# Altium schematic sheet Guide_laser.SchDoc
size 420 x 297 mm; Address1: Address1; Address2: Address2; Address3: Address3; Address4: Address4; DocumentNumber: *Э3; SheetNumber: 6; SheetTotal: 14; DocumentType: Схема электрическая *
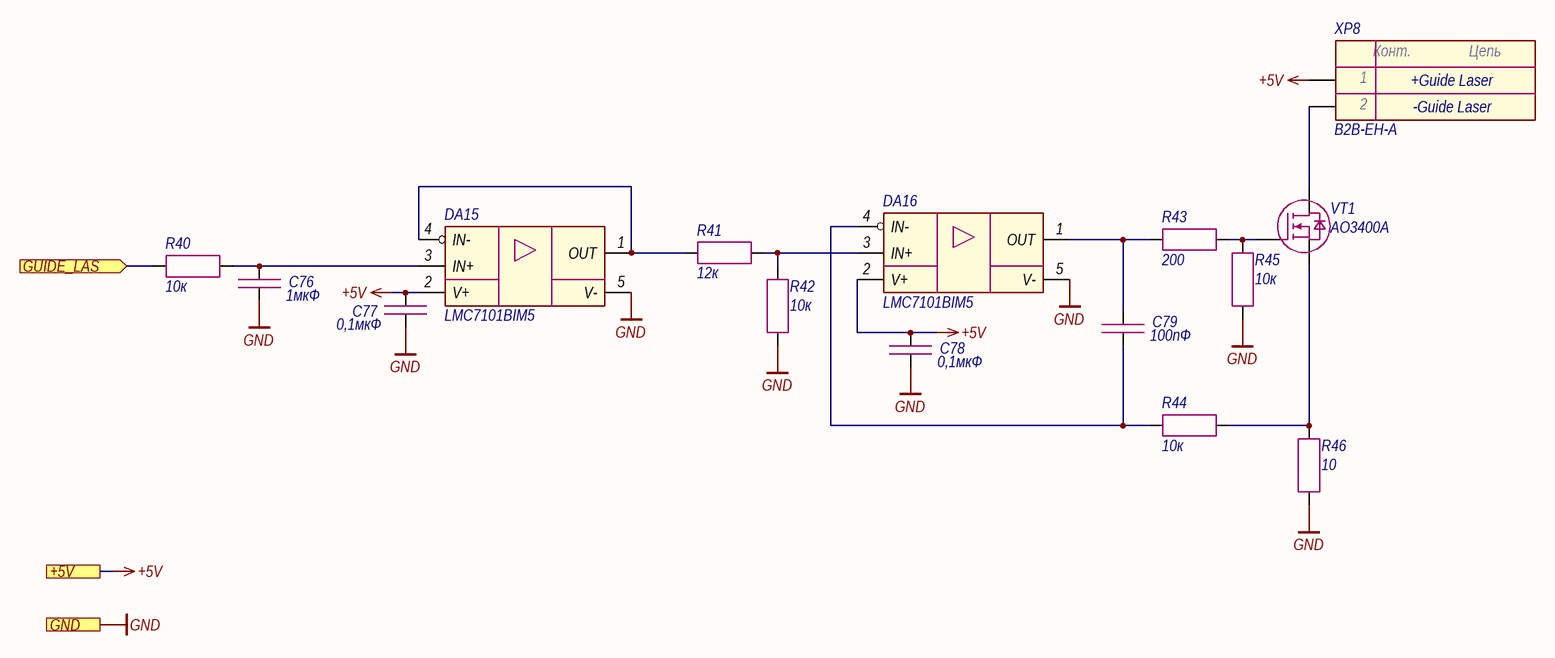
[diagram p0: Guide_laser.SchDoc]

## Parts
C76  1мкФ  [CAP_0603]
C77  0,1мкФ  [CAP_0603]
C78  0,1мкФ  [CAP_0603]
C79  100пФ  [CAP_0603]
DA15  LMC7101BIM5  [SOT-23-5]
DA16  LMC7101BIM5  [SOT-23-5]
R40  10к  [RES_0603]
R41  12к  [RES_0603]
R42  10к  [RES_0603]
R43  200  [RES_0603]
R44  10к  [RES_0603]
R45  10к  [RES_0603]
R46  10  [RES_1210]
VT1  AO3400A  [SOT-23-3]
XP8  B2B-EH-A  [B2B-EH-A]

## Ports
+5V (see Main[2C]), GND (see Main[2C], Button[1D], Column[1C], Ethernet[3D], Fiber_interlock[2C], Flow_sensor[2C], Indication[1C], LD_driver[1D], Power_supply[2C], RS-485[2C]), GUIDE_LAS (in, see Main[2C])

## Nets
+5V: C77.1 C78.1 DA15.2(V+) DA16.2(V+) XP8.1 ; port +5V
GND: C76.2 C77.2 C78.2 DA15.5(V-) DA16.5(V-) R42.2 R45.1 R46.1 ; port GND
GUIDE_LAS: R40.1 ; port GUIDE_LAS
NetC76_1: C76.1 DA15.3(IN+) R40.2
NetC79_1: C79.1 DA16.1(OUT) R43.1
NetC79_2: C79.2 DA16.4(IN-) R44.1
NetDA15_1: DA15.1(OUT) DA15.4(IN-) R41.1
NetDA16_3: DA16.3(IN+) R41.2 R42.1
NetR43_2: R43.2 R45.2 VT1.1(G)
NetR44_2: R44.2 R46.2 VT1.2(S)
NetVT1_3: VT1.3(D) XP8.2

## Notes on the sheet
- +Guide Laser
- -Guide Laser
- Подп. и дата
- Инв. № дубл.
- Взам. инв. №
- Инв. № подл.
- Изм.
- Лист
- № докум.
- Подп.
- Дата
- Копировал
- Формат А3
- (in symbol Connector-2) Конт.; Цепь

## Library data of the parts
C76 = Capacitor: Manufacturer: Murata; Model: GRM188R61H105KAALD; Value: 1мкФ; Document: *
C77 C78 = Capacitor: Manufacturer: Murata; Model: GRM188R71H104KA93D; Value: 0,1мкФ; Document: *
C79 = Capacitor: Manufacturer: Murata; Model: GRM1885C1H101JA01D; Value: 100пФ; Document: *
DA15 DA16 = LMC7101: Manufacturer: Texas Instruments; Model: LMC7101BIM5; Document: *
R40 R42 R44 R45 = Resistor: Manufacturer: Yageo; Model: RC0603FR-0710KL; Value: 10к; Document: *
R41 = Resistor: Manufacturer: Yageo; Model: RC0603FR-0712KL; Value: 12к; Document: *
R43 = Resistor: Manufacturer: Yageo; Model: RC0603FR-07200RL; Value: 200; Document: *
R46 = Resistor: Manufacturer: Yageo; Model: RC1210FR-0710RL; Value: 10; Document: *
VT1 = MOSFET N-channel: Manufacturer: UMW; Model: AO3400A; Document: *
XP8 = Connector-2: Manufacturer: JST; Model: B2B-EH-A; Document: *